# Altium schematic sheet 6_sha.SchDoc
size A; SheetNumber: 6; SheetTotal: 7
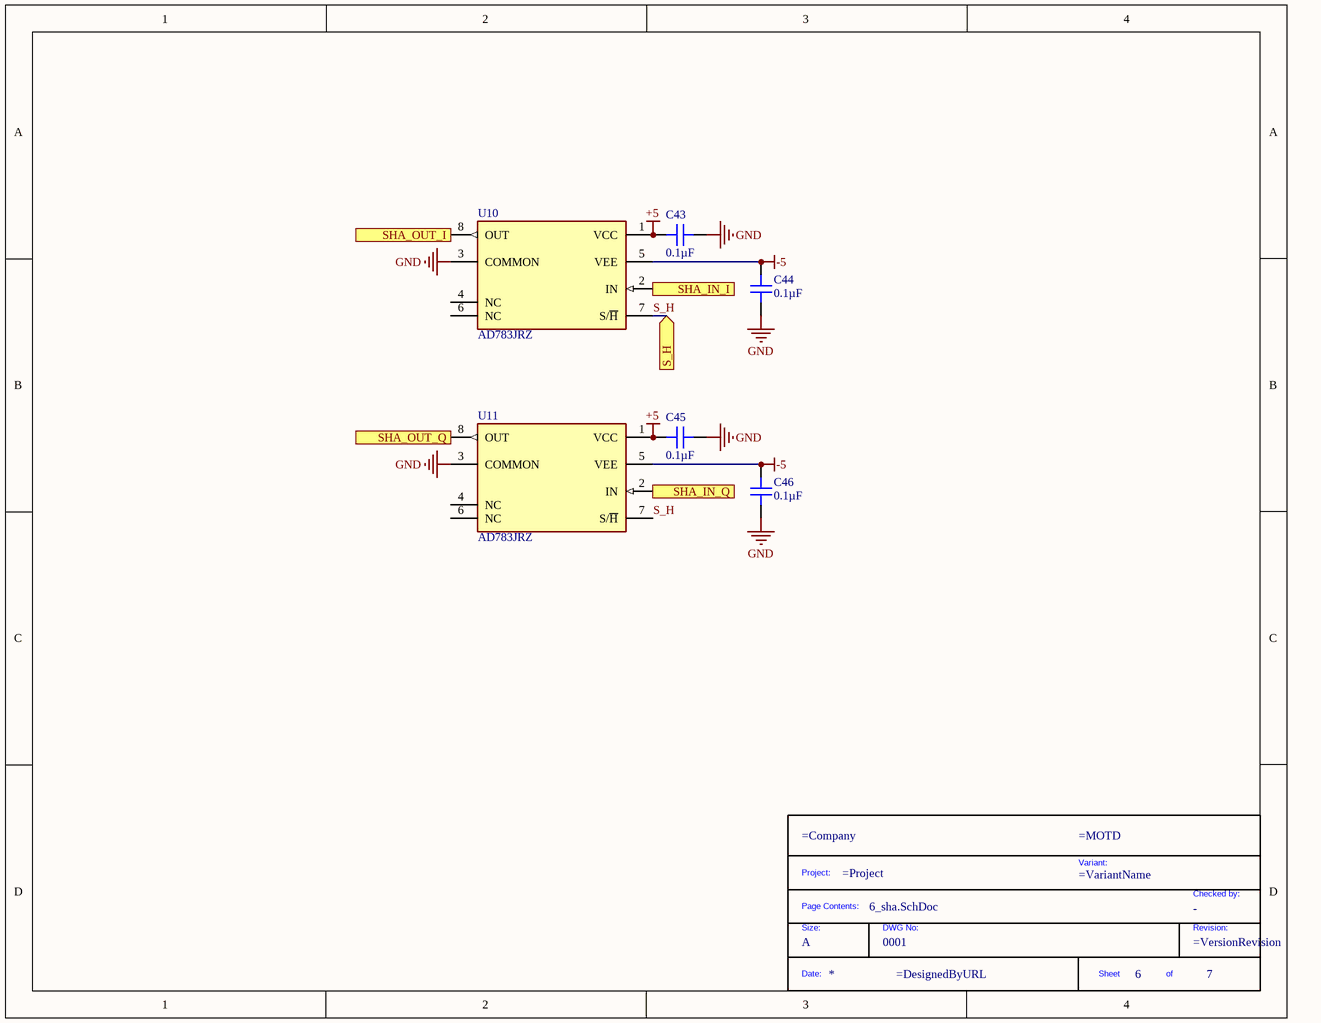
[diagram p0: 6_sha.SchDoc]

## Parts
*?  DWG No: 0001  Size: A  (hidden comment: TitleBlock)  (graphical)
C43  0.1µF  [CAP 1206_3216 - 1.0MM]
C44  0.1µF  [CAP 1206_3216 - 1.0MM]
C45  0.1µF  [CAP 1206_3216 - 1.0MM]
C46  0.1µF  [CAP 1206_3216 - 1.0MM]
U10  AD783JRZ  [FP-R-8-IPC_B]
U11  AD783JRZ  [FP-R-8-IPC_B]

## Ports
S_H (in), SHA_IN_I (in), SHA_IN_Q (in), SHA_OUT_I (out), SHA_OUT_Q (out)

## Nets
+5: C43.1 C45.1 U10.1(VCC) U11.1(VCC)
-5: C44.2 C46.1 U10.5(VEE) U11.5(VEE)
GND: C43.2 C44.1 C45.2 C46.2 U10.3(COMMON) U11.3(COMMON)
S_H: U10.7(S/~{H}) U11.7(S/~{H}) ; port S_H
SHA_IN_I: U10.2(IN) ; port SHA_IN_I
SHA_IN_Q: U11.2(IN) ; port SHA_IN_Q
SHA_OUT_I: U10.8(OUT) ; port SHA_OUT_I
SHA_OUT_Q: U11.8(OUT) ; port SHA_OUT_Q

Not connected (* = marked no-connect by the designer): U10 4(NC) 6(NC); U11 4(NC) 6(NC)

## Notes on the sheet
- (in symbol TitleBlock) Project:; Variant:; Checked by:; Page Contents:; Size:; DWG No:; Revision:; Date:; Sheet; of

## Library data of the parts
*? = TitleBlock: Standard Title Block; Checked by: -
C43-C46 = 12065C104JAT2A: CAP CER 0.1UF 50V X7R 1206; manufacturer: AVX Corporation; Tolerance: ±5%; Part Number: 12065C104JAT2A; Value: 0.1µF; Applications: General Purpose; Capacitance: 0.1µF; componentlink1description: Datasheet; componentlink1url: http://datasheets.avx.com/X7RDielectric.pdf; componentlink2description: DigiKey Link; componentlink2url: http://digikey.com/product-detail/en/avx-corporation/12065C104JAT2A/478-3797-1-ND/1116495; Device Package: 1206 (3216 Metric); lastupdated: 2020-09-02 01:05:06; Lifecycle Status: Active; Minimum Order: 1; Mounting Type: Surface Mount, MLCC; Operating Temperature: -55°C ~ 125°C; Package / Case: 1206 (3216 Metric); packaging: TapeAndReel; partid: 19088; Part Status: Active; price: 0.06; series: -; Size / Dimension: 0.126" L x 0.063" W (3.20mm x 1.60mm); Supplier 1: DigiKey; Supplier Part Number 1: 478-3797-1-ND; Temperature Coefficient: X7R; Thickness (Max): 0.037" (0.94mm); Voltage - Rated: 50V
U10 U11 = CMP-09116-000396-1: IC SAMPL/HOLD 1 CIRCUIT 8SOIC; Operating Supply Current: 9.5mA; Settling Time: 150ns; Dual Supply Voltage: 5V; Input Offset Voltage (Vos): 50mV; Number of Circuits: 1; -3db Bandwidth: 15MHz; Output Current per Channel: 5mA; Max Supply Voltage: 5.25V; Input Bias Current: 100nA; Min Supply Voltage: 4.75V; RoHS Compliant: Yes; Max Operating Temperature: 70°C; Mount: Surface Mount; REACH SVHC: No SVHC; Min Operating Temperature: 0°C; Case/Package: SOIC; Number of Amplifiers: 1; Height: 2.45mm; Contact Plating: Tin; Bandwidth: 15MHz; Lead Free: Contains Lead; Number of Pins: 8; Width: 4.01mm; Number of Channels: 1; Length: 5mm; Package Quantity: 1; Series: -; Max Dual Supply Voltage: 5.25V; Min Dual Supply Voltage: 4.75V; Operating Supply Voltage: 5V; Packaging: Rail/Tube